# Altium schematic sheet [04] - POWER DIAGRAM.SchDoc: Power Diagram
size A3; Date: 23/3/2025; DrawnBy: Le Viet Trong; Revision: V1.1; SheetNumber: 4; SheetTotal: 6
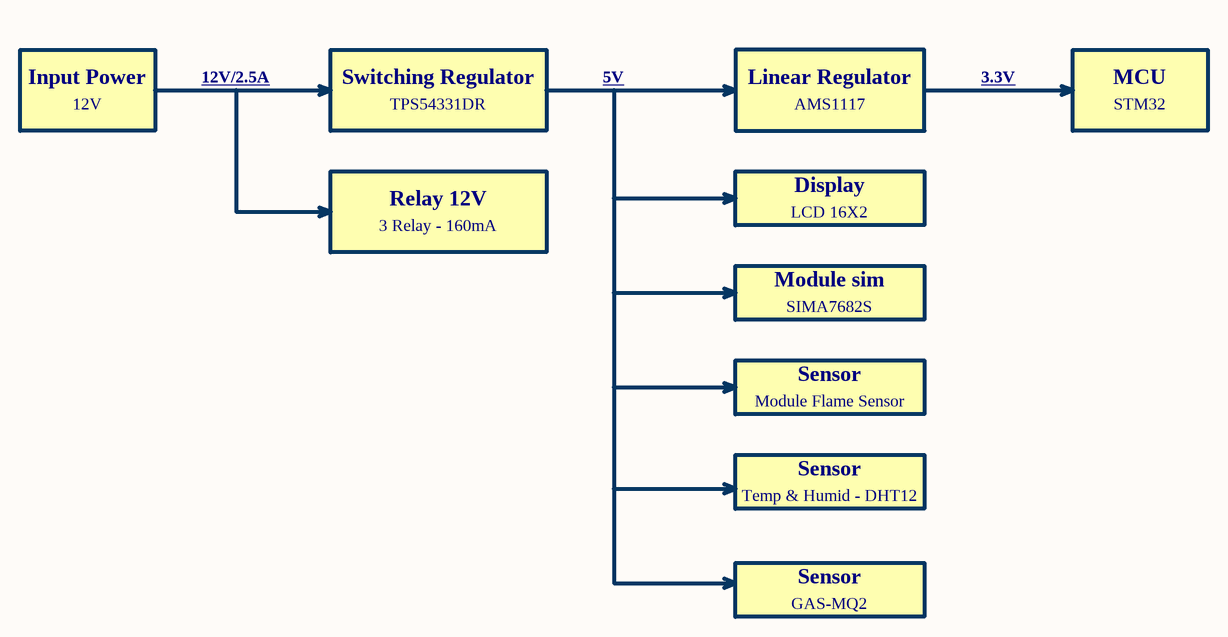
[diagram p0: [04] - POWER DIAGRAM.SchDoc]

## Notes on the sheet
- Input Power
- 12V
- 12V/2.5A
- TPS54331DR
- Switching Regulator
- 5V
- Linear Regulator
- AMS1117
- 3.3V
- MCU
- STM32
- Relay 12V
- 3 Relay - 160mA
- Display
- LCD 16X2
- Module sim
- SIMA7682S
- Sensor
- Module Flame Sensor
- Temp & Humid - DHT12
- GAS-MQ2
- Title:
- Desc:
- Designed by:
- Checked by:
- Date:
- Document No:
- Revision:
- Size:
- A3
- Approved by:
- Sheet
- of